# Altium schematic sheet Controller.SchDoc
size B
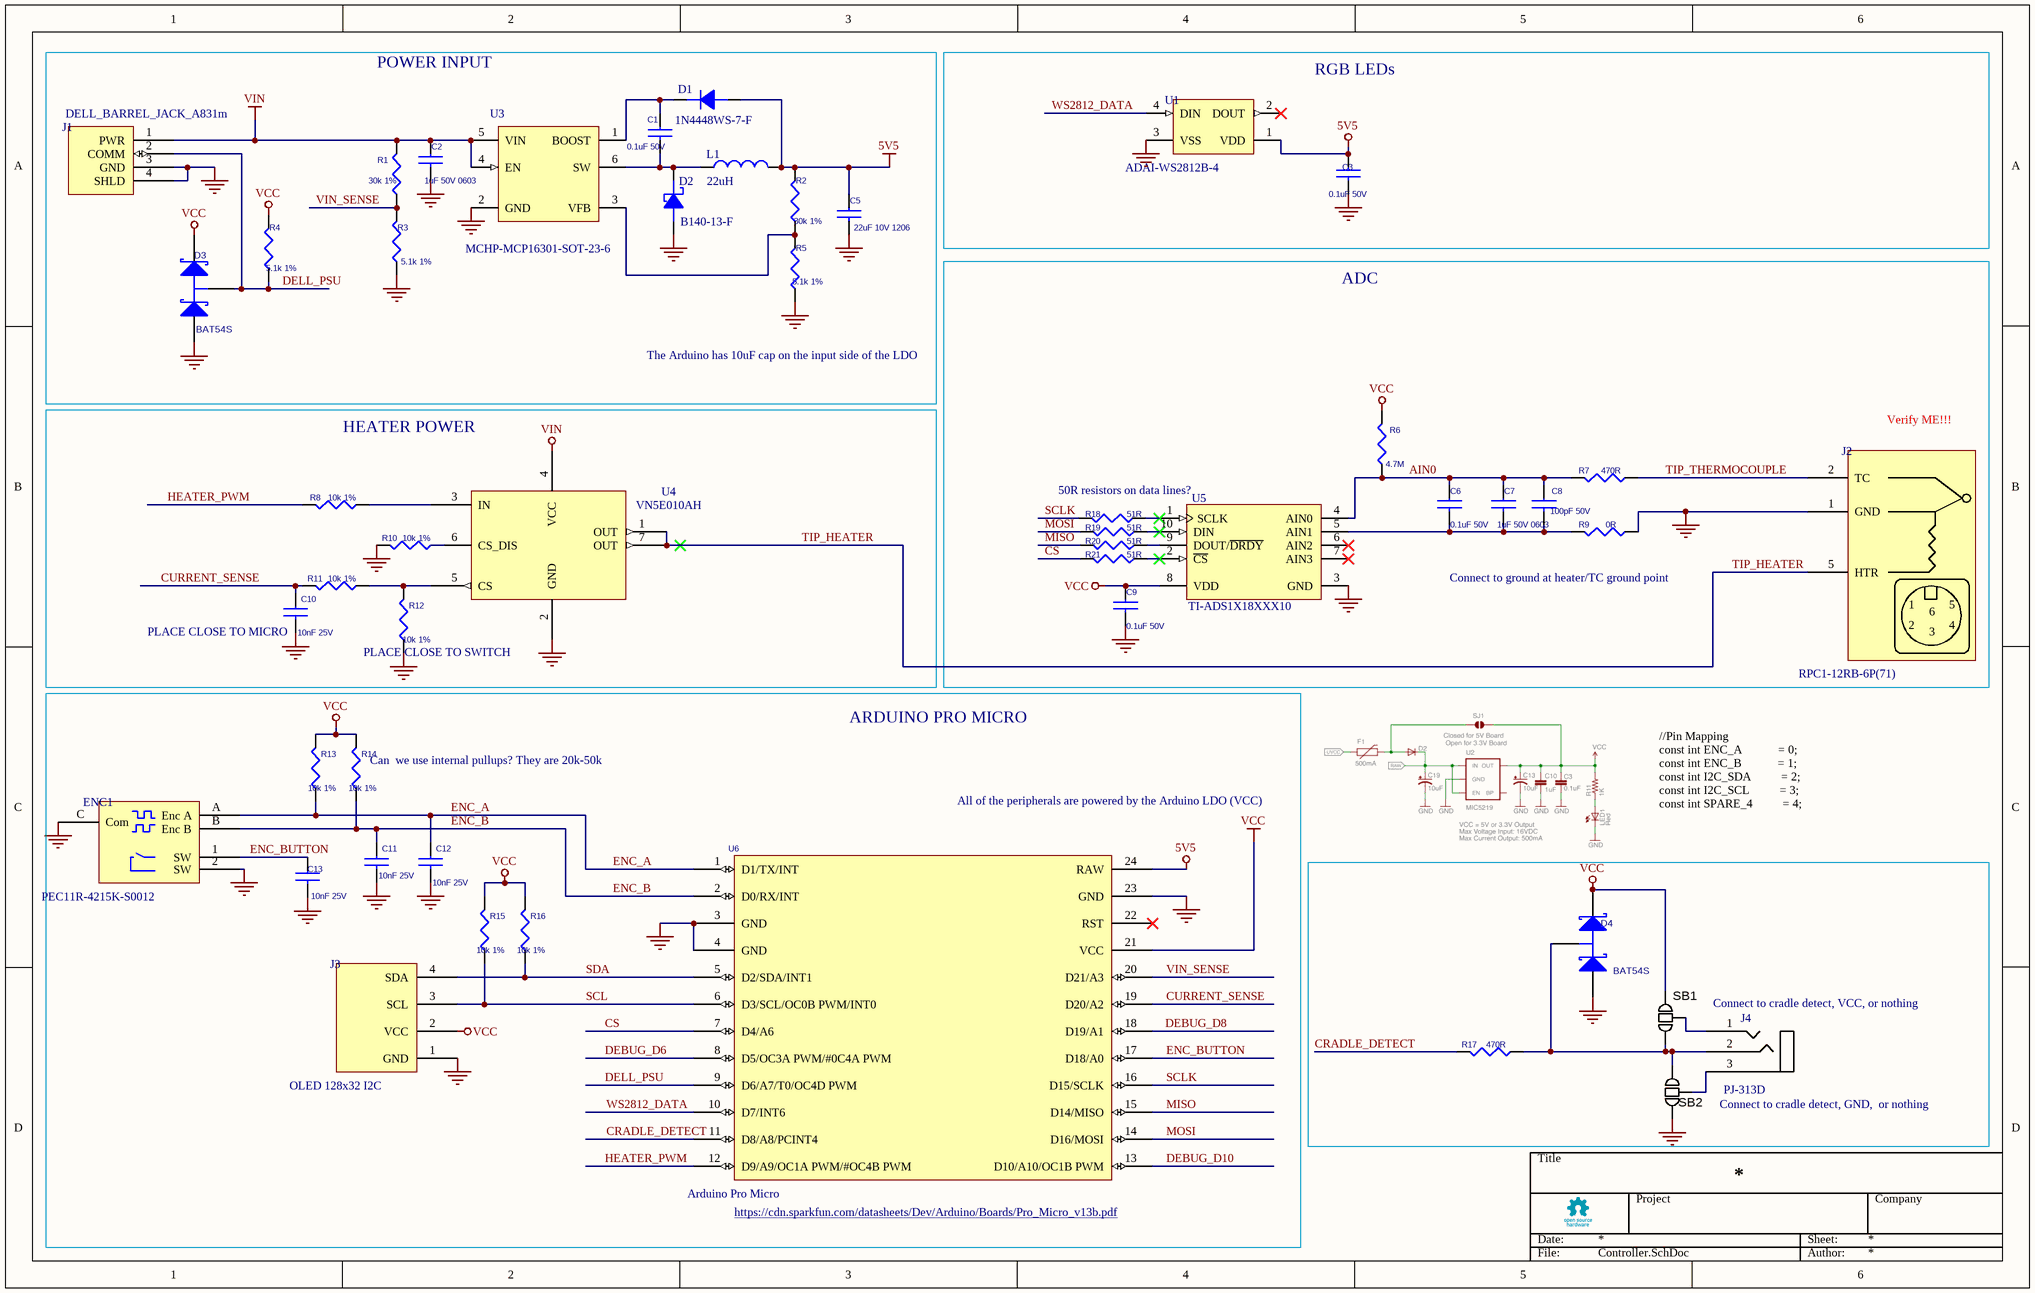
[diagram p0: Controller.SchDoc]

## Parts
C1  0.1uF 50V  [CAPC1608N]
C2  1uF 50V 0603  [CAPC1608N]
C3  0.1uF 50V  [CAPC1608N]
C5  22uF 10V 1206  [CAPC3216N]
C6  0.1uF 50V  [CAPC1608N]
C7  1uF 50V 0603  [CAPC1608N]
C8  100pF 50V  [CAPC1608N]
C9  0.1uF 50V  [CAPC1608N]
C10  10nF 25V  [CAPC1608N]
C11  10nF 25V  [CAPC1608N]
C12  10nF 25V  [CAPC1608N]
C13  10nF 25V  [CAPC1608N]
D1  1N4448WS-7-F  [1N4448WS-7-F]
D2  B140-13-F  [DO-214AC SMA]
D3  BAT54S  [BAT54SLT1G]
D4  BAT54S  [BAT54SLT1G]
ENC1  PEC11R-4215K-S0012  [PEC11R-4215K-S0012]
J1  DELL_BARREL_JACK_A831m  [DELL_POWER_JACK_A831m]
J2  RPC1-12RB-6P(71)  [Hirose-RPC1]
J3  OLED 128x32 I2C  [OLED 128x32 I2C]
J4  PJ-313D  [PJ-313D]
L1  22uH  [SRN5040-220M]
R1  30k 1%  [RESC1608N]
R2  30k 1%  [RESC1608N]
R3  5.1k 1%  [RESC1608N]
R4  5.1k 1%  [RESC1608N]
R5  5.1k 1%  [RESC1608N]
R6  4.7M  [RESC1608N]
R7  470R  [RESC1608N]
R8  10k 1%  [RESC1608N]
R9  0R  [RESC1608N]
R10  10k 1%  [RESC1608N]
R11  10k 1%  [RESC1608N]
R12  10k 1%  [RESC1608N]
R13  10k 1%  [RESC1608N]
R14  10k 1%  [RESC1608N]
R15  10k 1%  [RESC1608N]
R16  10k 1%  [RESC1608N]
R17  470R  [RESC1608N]
R18  51R  [RESC1608N]
R19  51R  [RESC1608N]
R20  51R  [RESC1608N]
R21  51R  [RESC1608N]
SB1  SOLDER_JUMPER_1X3_50  [SOLDER_JUMPER_1X3_50]  (value not drawn)  (no BOM)
SB2  SOLDER_JUMPER_1X3_50  [SOLDER_JUMPER_1X3_50]  (value not drawn)  (no BOM)
U1  ADAI-WS2812B-4  [ADAI-WS2812B_V]
U3  MCHP-MCP16301-SOT-23-6  [MCP16301]
U4  VN5E010AH  [VN5E010AH]
U5  TI-ADS1X18XXX10  [ADS1118]
U6  Arduino Pro Micro  [Arduinno Pro Micro]

## Blocks framed on the sheet
POWER INPUT: C1 C2 C5 D1-D3 J1 L1 R1-R5 U3
RGB LEDs: C3 U1
ADC: C6-C9 J2 R6 R7 R9 R18-R21 U5
HEATER POWER: C10 R8 R10-R12 U4
ARDUINO PRO MICRO: C11-C13 ENC1 J3 R13-R16 U6

## Nets
5V5: C3.1 C5.1 D1.A L1.2 R2.2 U1.1(VDD) U6.24(RAW)
GND: C2.2 C3.2 C5.2 C9.2 C10.2 C11.2 C12.2 C13.2 D2.A D3.1(A) D4.1(A) ENC1.2(SW) ENC1.C(Com) J1.3(GND) J1.4(SHLD) J2.1(GND) J3.1(GND) R3.1 R5.1 R9.1 R10.2 R12.1 SB2.2 U1.3(VSS) U3.2(GND) U4.2(GND) U5.3(GND) U6.3(GND) U6.4(GND) U6.23(GND)
VCC: C9.1 D3.2(K) D4.2(K) J3.2(VCC) R4.2 R6.2 R13.2 R14.2 R15.2 R16.2 SB1.3 U5.8(VDD) U6.21(VCC)
VIN: C2.1 J1.1(PWR) R1.2 U3.4(EN) U3.5(VIN) U4.4(VCC)
AIN0: C6.1 C7.1 C8.1 R6.1 R7.2 U5.4(AIN0)
CRADLE_DETECT: R17.2 U6.11(D8/A8/PCINT4)
CS: R21.2 U6.7(D4/A6)
CURRENT_SENSE: C10.1 R11.2 U6.19(D20/A2)
DEBUG_D6: U6.8(D5/OC3A_PWM/#0C4A_PWM)
DEBUG_D8: U6.18(D19/A1)
DEBUG_D10: U6.13(D10/A10/OC1B_PWM)
DELL_PSU: D3.3(C) J1.2(COMM) R4.1 U6.9(D6/A7/T0/OC4D_PWM)
ENC_A: C12.1 ENC1.A(Enc_A) R13.1 U6.1(D1/TX/INT)
ENC_B: C11.1 ENC1.B(Enc_B) R14.1 U6.2(D0/RX/INT)
ENC_BUTTON: C13.1 ENC1.1(SW) U6.17(D18/A0)
HEATER_PWM: R8.2 U6.12(D9/A9/OC1A_PWM/#OC4B_PWM)
MISO: R20.2 U6.15(D14/MISO)
MOSI: R19.2 U6.14(D16/MOSI)
SCL: J3.3(SCL) R15.1 U6.6(D3/SCL/OC0B_PWM/INT0)
SCLK: R18.2 U6.16(D15/SCLK)
SDA: J3.4(SDA) R16.1 U6.5(D2/SDA/INT1)
TIP_HEATER: J2.5(HTR) U4.1(OUT) U4.7(OUT)
TIP_THERMOCOUPLE: J2.2(TC) R7.1
VIN_SENSE: R1.1 R3.2 U6.20(D21/A3)
WS2812_DATA: U1.4(DIN) U6.10(D7/INT6)
NetC1_1: C1.1 D1.K U3.1(BOOST)
NetC1_2: C1.2 D2.K L1.1 U3.6(SW)
NetC6_2: C6.2 C7.2 C8.2 R9.2 U5.5(AIN1)
NetD4_3: D4.3(C) J4.2 R17.1 SB1.2 SB2.3
NetJ4_1: J4.1 SB1.1
NetJ4_3: J4.3 SB2.1
NetR2_1: R2.1 R5.2 U3.3(VFB)
NetR8_1: R8.1 U4.3(IN)
NetR10_1: R10.1 U4.6(CS_DIS)
NetR11_1: R11.1 R12.2 U4.5(CS)
NetR18_1: R18.1 U5.1(SCLK)
NetR19_1: R19.1 U5.10(DIN)
NetR20_1: R20.1 U5.9(DOUT/~{DRDY})
NetR21_1: R21.1 U5.2(~{CS})

Not connected (* = marked no-connect by the designer): U1 2(DOUT)*; U5 6(AIN2)* 7(AIN3)*; U6 22(RST)*

## Notes on the sheet
- The Arduino has 10uF cap on the input side of the LDO
- Verify ME!!!
- 50R resistors on data lines?
- (near C10) PLACE CLOSE TO MICRO
- Connect to ground at heater/TC ground point
- (near R12) PLACE CLOSE TO SWITCH
- (near R14) Can  we use internal pullups? They are 20k-50k
- All of the peripherals are powered by the Arduino LDO (VCC)
- //Pin Mapping
  const int ENC_A            = 0;
  const int ENC_B            = 1;
  const int I2C_SDA          = 2;
  const int I2C_SCL          = 3;
  const int SPARE_4          = 4;
  const int DELL_PSU         = 5;
  const int debug_pin_B      = 6;
  const int debug_pin_A      = 7;
  const int CS               = 7;
  const int SPARE_8          = 8;
  const int LPINA            = 9;  //Heater PWM
  const int LPINB            = 10;
  const int SPI_MISO         = 14;
  const int SPI_SCLK         = 15;
  const int SPI_MOSI         = 16;
  const int ENC_BUTTON       = 18; //Maybe this should be an interrupt. if it does, we need to move CS to a different pin
  const int SPARE_19         = 19;
  const int CURRENT_SENSE    = 20;
  const int CRADLE_SENSOR    = 21;
  const int OLED_RESET       = 4; //the library asks for a reset pin, but our OLED doesn't have one
- (near J4) Connect to cradle detect, VCC, or nothing
- Connect to cradle detect, GND,  or nothing
- (near U6) https://cdn.sparkfun.com/datasheets/Dev/Arduino/Boards/Pro_Micro_v13b.pdf
- Title
- Date:
- Project
- Sheet:
- Company
- File:
- Author:
- (in symbol RPC1-12RB-6P(71)) 6; 4; 3

## Library data of the parts
C1 C3 C6 C9 = CAP NP: CAP CER 0.1UF 50V X7R 0603; Manufacturer Part Number: CC0603KRX7R9BB104; Manufacturer: Yageo; Capacitance: 0.1µF; Tolerance: ±10%; checksum: 1132437632; Supplier 1: Digi-Key; Supplier Part Number 1: 311-1344-1-ND; Lead Free Status / RoHS Status: Lead free / RoHS Compliant; Part Status: Active; Operating Temperature: -55°C ~ 125°C; Package / Case: 0603 (1608 Metric); Voltage - Rated: 50V; Temperature Coefficient: X7R; Quantity Available: 3,506,905 / Can ship immediately
C2 C7 = CAP NP: CAP CER 1UF 50V X7R 0603; Manufacturer Part Number: CC0603KRX7R9BB105; Manufacturer: Yageo; Capacitance: 1µF; Tolerance: ±10%; checksum: 2560902375; Supplier 1: Digi-Key; Supplier Part Number 1: 311-2082-1-ND; Lead Free Status / RoHS Status: Lead free / RoHS Compliant; Part Status: Active; Operating Temperature: -55°C ~ 125°C; Package / Case: 0603 (1608 Metric); Voltage - Rated: 50V; Temperature Coefficient: X7R; Quantity Available: 21,666 / Can ship immediately
C5 = CAP NP: CAP CER 22UF 10V X7R 1206; Manufacturer Part Number: C1206C226M8RACTU; Manufacturer: KEMET; Capacitance: 22µF; Tolerance: ±20%; checksum: 1967367642; Supplier 1: Digi-Key; Supplier Part Number 1: 399-7444-1-ND; Lead Free Status / RoHS Status: Lead free / RoHS Compliant; Part Status: Active; Operating Temperature: -55°C ~ 125°C; Package / Case: 1206 (3216 Metric); Voltage - Rated: 10V; Temperature Coefficient: X7R; Quantity Available: 28,944 / Can ship immediately
C8 = CAP NP: CAP CER 100PF 50V X7R 0603; Manufacturer Part Number: VJ0603Y101KXACW1BC; Manufacturer: Vishay Vitramon; Tolerance: ±10%; checksum: 430446505; Supplier 1: Digi-Key; Supplier Part Number 1: 720-1373-1-ND; Lead Free Status / RoHS Status: Lead free / RoHS Compliant; Part Status: Active; Operating Temperature: -55°C ~ 125°C; Package / Case: 0603 (1608 Metric); Voltage - Rated: 50V; Capacitance: 100pF; Temperature Coefficient: X7R; Quantity Available: 35,049 / Can ship immediately
C10-C13 = CAP NP: CAP CER 10000PF 50V X7R 0603; Manufacturer Part Number: CC0603MRX7R9BB103; Manufacturer: Yageo; Tolerance: ±20%; checksum: 443124419; Supplier 1: Digi-Key; Supplier Part Number 1: 311-1826-1-ND; Lead Free Status / RoHS Status: Lead free / RoHS Compliant; Part Status: Active; Operating Temperature: -55°C ~ 125°C; Package / Case: 0603 (1608 Metric); Voltage - Rated: 50V; Capacitance: 10000pF; Temperature Coefficient: X7R; Quantity Available: 28,006 / Can ship immediately
D1 = 1N4448WS-7-F: DIODE GEN PURP 75V 250MA SOD323; Manufacturer: Diodes Incorporated; checksum: 3616671784; Supplier 1: Digi-Key; Supplier Part Number 1: 1N4448WS-FDICT-ND; Manufacturer Part Number: 1N4448WS-7-F; Lead Free Status / RoHS Status: Lead free / RoHS Compliant; Part Status: Active; Quantity Available: 26,438 / Can ship immediately
D2 = B140-13-F: DIODE SCHOTTKY 40V 1A SMA; Manufacturer: Diodes Incorporated; checksum: 1412311243; Supplier 1: Digi-Key; Supplier Part Number 1: B140-FDICT-ND; Manufacturer Part Number: B140-13-F; Lead Free Status / RoHS Status: Lead free / RoHS Compliant; Part Status: Active; Quantity Available: 350,633 / Can ship immediately
D3 D4 = BAT54S: DIODE ARRAY SCHOTTKY 30V SOT23-3; Manufacturer: ON Semiconductor; Assembly: SMT; checksum: 3914466152; Supplier 1: Digi-Key; Supplier Part Number 1: BAT54SLT1GOSCT-ND; Manufacturer Part Number: BAT54SLT1G; Lead Free Status / RoHS Status: Lead free / RoHS Compliant; Part Status: Active
ENC1 = PEC11R-4215K-S0012: ENCODER ROTARY; Manufacturer: Bourns Inc.; checksum: 2698813099; Supplier 1: Digi-Key; Supplier Part Number 1: PEC11R-4215K-S0012-ND; Manufacturer Part Number: PEC11R-4215K-S0012; Lead Free Status / RoHS Status: Lead free / RoHS Compliant; Part Status: Active; Quantity Available: This feature is temporarily unavailable. We are working diligently to get this fixed. Thank you for your patience.
J1 = DELL_BARREL_JACK_A831m: checksum: 2333158291
J2 = RPC1-12RB-6P(71): CONN RECEPT 6 POS W/PINS; Manufacturer: Hirose Electric Co Ltd; checksum: 3790889223; Manufacturer Part Number: RPC1-12RB-6P(71); Lead Free Status / RoHS Status: Lead free / RoHS Compliant; Part Status: Active; Supplier Part Number 1: HR1817-ND; Supplier 1: Digi-Key; Quantity Available: 3,450 / Can ship immediately
J3 = OLED 128x32 I2C: checksum: 105053370
J4 = PJ-313D: checksum: 526150384
L1 = Inductor: FIXED IND 22UH 1.4A 152 MOHM SMD; Manufacturer: Bourns Inc.; Inductance: 22µH; Tolerance: ±20%; checksum: 2098910702; Supplier 1: Digi-Key; Supplier Part Number 1: SRN5040-220MCT-ND; Manufacturer Part Number: SRN5040-220M; Lead Free Status / RoHS Status: Lead free / RoHS Compliant; Part Status: Active; Operating Temperature: -40°C ~ 125°C; Package / Case: Nonstandard; Current Rating: 1.4A; Quantity Available: 268 / Can ship immediately
R1 R2 = RES: RES SMD 30K OHM 1% 1/10W 0603; Manufacturer Part Number: RC0603FR-0730KL; Manufacturer: Yageo; Power (Watts): 0.1W, 1/10W; Temperature Coefficient: ±100ppm/°C; Resistance: 30 kOhms; checksum: 1935724738; Supplier Part Number 1: 311-30.0KHRCT-ND; Supplier 1: Digi-Key; Lead Free Status / RoHS Status: Lead free / RoHS Compliant; Part Status: Active; Operating Temperature: -55°C ~ 155°C; Package / Case: 0603 (1608 Metric); Tolerance: ±1%; Quantity Available: 523,106 / Can ship immediately
R3-R5 = RES: RES SMD 5.1K OHM 1% 1/10W 0603; Manufacturer Part Number: RC0603FR-075K1L; Manufacturer: Yageo; Power (Watts): 0.1W, 1/10W; Temperature Coefficient: ±100ppm/°C; Resistance: 5.1 kOhms; checksum: 1119091354; Supplier Part Number 1: 311-5.10KHRCT-ND; Supplier 1: Digi-Key; Lead Free Status / RoHS Status: Lead free / RoHS Compliant; Part Status: Active; Operating Temperature: -55°C ~ 155°C; Package / Case: 0603 (1608 Metric); Tolerance: ±1%; Quantity Available: 562,848 / Can ship immediately
R6 = RES: RES SMD 4.7M OHM 5% 1/10W 0603; Manufacturer Part Number: RC0603JR-074M7L; Manufacturer: Yageo; Power (Watts): 0.1W, 1/10W; Temperature Coefficient: ±100ppm/°C; Resistance: 4.7 MOhms; checksum: 2282677216; Supplier Part Number 1: 311-4.7MGRCT-ND; Supplier 1: Digi-Key; Lead Free Status / RoHS Status: Lead free / RoHS Compliant; Part Status: Active; Operating Temperature: -55°C ~ 155°C; Package / Case: 0603 (1608 Metric); Tolerance: ±5%; Quantity Available: 109,790 / Can ship immediately
R7 R17 = RES: RES SMD 470 OHM 5% 1/10W 0603; Manufacturer Part Number: RC0603JR-07470RL; Manufacturer: Yageo; Power (Watts): 0.1W, 1/10W; Temperature Coefficient: ±100ppm/°C; Resistance: 470 Ohms; checksum: 333396419; Supplier Part Number 1: 311-470GRCT-ND; Supplier 1: Digi-Key; Lead Free Status / RoHS Status: Lead free / RoHS Compliant; Part Status: Active; Operating Temperature: -55°C ~ 155°C; Package / Case: 0603 (1608 Metric); Tolerance: ±5%; Quantity Available: 1,750,390 / Can ship immediately
R8 R10-R16 = RES: RES SMD 10K OHM 1% 1/10W 0603; Manufacturer Part Number: RC0603FR-0710KL; Manufacturer: Yageo; Power (Watts): 0.1W, 1/10W; Temperature Coefficient: ±100ppm/°C; Resistance: 10 kOhms; checksum: 2906948183; Supplier Part Number 1: 311-10.0KHRCT-ND; Supplier 1: Digi-Key; Lead Free Status / RoHS Status: Lead free / RoHS Compliant; Part Status: Active; Operating Temperature: -55°C ~ 155°C; Package / Case: 0603 (1608 Metric); Tolerance: ±1%; Quantity Available: 20,748,555 / Can ship immediately
R9 = RES: RES SMD 0.0OHM JUMPER 1/10W 0603; Manufacturer Part Number: RC0603JR-070RL; Manufacturer: Yageo; Power (Watts): 0.1W, 1/10W; Resistance: 0 Ohms; checksum: 3004877045; Supplier Part Number 1: 311-0.0GRCT-ND; Supplier 1: Digi-Key; Lead Free Status / RoHS Status: Lead free / RoHS Compliant; Part Status: Active; Operating Temperature: -55°C ~ 155°C; Package / Case: 0603 (1608 Metric); Temperature Coefficient: -; Tolerance: Jumper; Quantity Available: 12,991,362 / Can ship immediately
R18-R21 = RES: RES SMD 51 OHM 5% 1/10W 0603; Manufacturer Part Number: RC0603JR-0751RL; Manufacturer: Yageo; Power (Watts): 0.1W, 1/10W; Temperature Coefficient: ±100ppm/°C; Resistance: 51 Ohms; checksum: 3548543910; Supplier Part Number 1: 311-51GRCT-ND; Supplier 1: Digi-Key; Lead Free Status / RoHS Status: Lead free / RoHS Compliant; Part Status: Active; Operating Temperature: -55°C ~ 155°C; Package / Case: 0603 (1608 Metric); Tolerance: ±5%; Quantity Available: 403,423 / Can ship immediately
SB1 SB2 = SOLDER_JUMPER_1X3_50: Solder Jumper 1X3; aa - Value: *
U1 = ADAI-WS2812B-4: checksum: 2457099131
U3 = MCHP-MCP16301-SOT-23-6: IC REG BUCK ADJ 0.6A SOT23-6; Manufacturer Part Number: MCP16301HT-E/CH; Manufacturer: Microchip Technology; checksum: 3785408565; Supplier 1: Digi-Key; Supplier Part Number 1: MCP16301HT-E/CHCT-ND; Lead Free Status / RoHS Status: Lead free / RoHS Compliant; Part Status: Active; Operating Temperature: -40°C ~ 125°C (TJ); Quantity Available: 8,930 / Can ship immediately
U4 = VN5E010AHTR-E: IC HIGH SIDE DRIVER 6-HPAK; Manufacturer: STMicroelectronics; checksum: 2957867641; Supplier 1: Digi-Key; Supplier Part Number 1: 497-10505-6-ND; Manufacturer Part Number: VN5E010AHTR-E; Lead Free Status / RoHS Status: Lead free / RoHS Compliant; Part Status: Active; Operating Temperature: -40°C ~ 150°C (TJ); Quantity Available: 7,494 / Can ship immediately
U5 = TI-ADS1X18XXX10: IC ADC 16BIT SPI 860SPS 10MSOP; Manufacturer Part Number: ADS1118IDGSR; Manufacturer: Texas Instruments; checksum: 549196599; Supplier 1: Digi-Key; Supplier Part Number 1: 296-38850-1-ND; Lead Free Status / RoHS Status: Lead free / RoHS Compliant; Part Status: Active; Operating Temperature: -40°C ~ 125°C; Quantity Available: 8,024 / Can ship immediately
U6 = Arduino Pro Micro: checksum: 3559930326